# Altium schematic sheet MCU.SchDoc
size A4; SheetNumber: 10; SheetTotal: 11
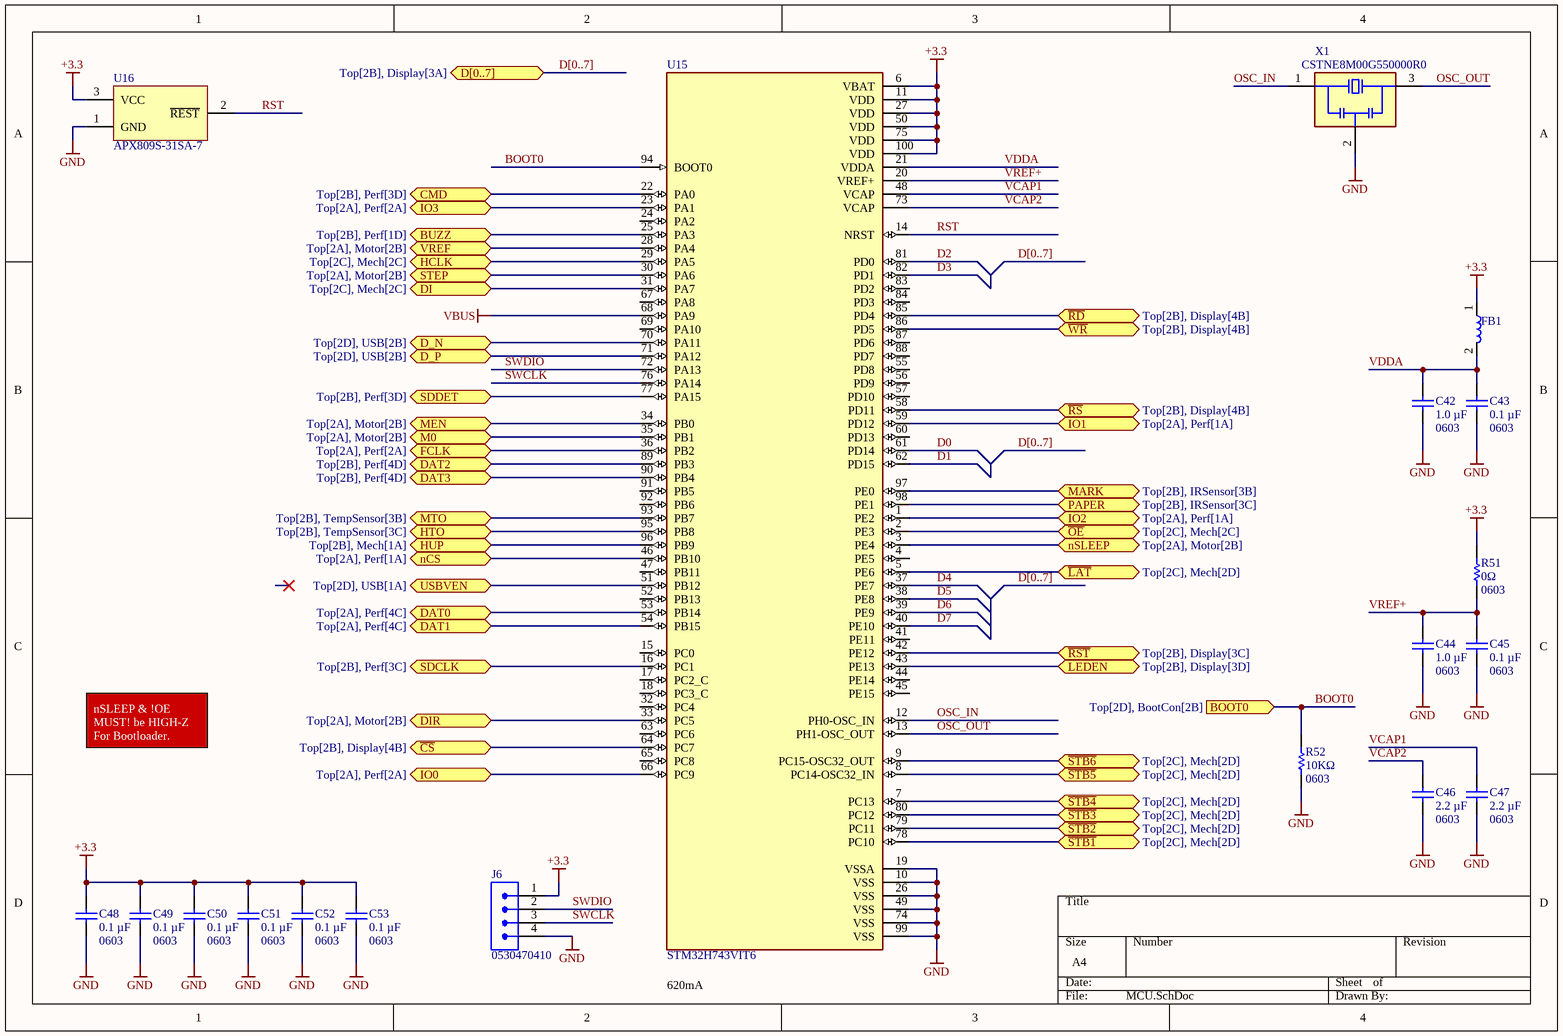
[diagram p0: MCU.SchDoc]

## Parts
C42  value 1.0 µF  [0603]  (hidden comment: GRM188D71H105KE01J)
C43  value 0.1 µF  [0603]  (hidden comment: GRM188R72A104MA35J)
C44  value 1.0 µF  [0603]  (hidden comment: GRM188D71H105KE01J)
C45  value 0.1 µF  [0603]  (hidden comment: GRM188R72A104MA35J)
C46  value 2.2 µF  [0603]  (hidden comment: GRM188R61E225KA12J)
C47  value 2.2 µF  [0603]  (hidden comment: GRM188R61E225KA12J)
C48  value 0.1 µF  [0603]  (hidden comment: GRM188R72A104MA35J)
C49  value 0.1 µF  [0603]  (hidden comment: GRM188R72A104MA35J)
C50  value 0.1 µF  [0603]  (hidden comment: GRM188R72A104MA35J)
C51  value 0.1 µF  [0603]  (hidden comment: GRM188R72A104MA35J)
C52  value 0.1 µF  [0603]  (hidden comment: GRM188R72A104MA35J)
C53  value 0.1 µF  [0603]  (hidden comment: GRM188R72A104MA35J)
FB1  MPZ1608S221ATA00  [0603]  (value not drawn)
J6  0530470410  [4POS]
R51  value 0Ω  [0603]  (hidden comment: RMCF0603ZT0R00)
R52  value 10KΩ  [0603]  (hidden comment: RMCF0603FG10K0)
U15  STM32H743VIT6  [100-LQFP]
U16  APX809S-31SA-7  [SOT-23-3]
X1  CSTNE8M00G550000R0  [3-SMD]

## Ports
BOOT0 (in, see Top[2D], BootCon[2B]), BUZZ (bidir, see Top[2B], Perf[1D]), CMD (bidir, see Top[2B], Perf[3D]), D[0..7] (bidir, see Top[2B], Display[3A]), D_N (bidir, see Top[2D], USB[2B]), D_P (bidir, see Top[2D], USB[2B]), DAT0 (bidir, see Top[2A], Perf[4C]), DAT1 (bidir, see Top[2A], Perf[4C]), DAT2 (bidir, see Top[2B], Perf[4D]), DAT3 (bidir, see Top[2B], Perf[4D]), DI (bidir, see Top[2C], Mech[2C]), DIR (bidir, see Top[2A], Motor[2B]), FCLK (bidir, see Top[2A], Perf[2A]), HCLK (bidir, see Top[2C], Mech[2C]), HTO (bidir, see Top[2B], TempSensor[3C]), HUP (bidir, see Top[2B], Mech[1A]), IO0 (bidir, see Top[2A], Perf[2A]), IO1 (bidir, see Top[2A], Perf[1A]), IO2 (bidir, see Top[2A], Perf[1A]), IO3 (bidir, see Top[2A], Perf[2A]), LEDEN (bidir, see Top[2B], Display[3D]), M0 (bidir, see Top[2A], Motor[2B]), MARK (bidir, see Top[2B], IRSensor[3B]), MEN (bidir, see Top[2A], Motor[2B]), MTO (bidir, see Top[2B], TempSensor[3B]), nCS (bidir, see Top[2A], Perf[1A]), nSLEEP (bidir, see Top[2A], Motor[2B]), PAPER (bidir, see Top[2B], IRSensor[3C]), SDCLK (bidir, see Top[2B], Perf[3C]), SDDET (bidir, see Top[2B], Perf[3D]), STEP (bidir, see Top[2A], Motor[2B]), USBVEN (bidir, see Top[2D], USB[1A]), VREF (bidir, see Top[2A], Motor[2B]), ~{CS} (bidir, see Top[2B], Display[4B]), ~{LAT} (bidir, see Top[2C], Mech[2D]), ~{OE} (bidir, see Top[2C], Mech[2C]), ~{RD} (bidir, see Top[2B], Display[4B]), ~{RST} (bidir, see Top[2B], Display[3C]), ~{RS} (bidir, see Top[2B], Display[4B]), ~{STB1} (bidir, see Top[2C], Mech[2D]), ~{STB2} (bidir, see Top[2C], Mech[2D]), ~{STB3} (bidir, see Top[2C], Mech[2D]), ~{STB4} (bidir, see Top[2C], Mech[2D]), ~{STB5} (bidir, see Top[2C], Mech[2D]), ~{STB6} (bidir, see Top[2C], Mech[2D]), ~{WR} (bidir, see Top[2B], Display[4B])

## Nets
+3.3: C48.2 C49.2 C50.2 C51.2 C52.2 C53.2 FB1.1 J6.1 R51.1 U15.6(VBAT) U15.11(VDD) U15.27(VDD) U15.50(VDD) U15.75(VDD) U15.100(VDD) U16.3(VCC)
GND: C42.1 C43.1 C44.1 C45.1 C46.1 C47.1 C48.1 C49.1 C50.1 C51.1 C52.1 C53.1 J6.4 R52.1 U15.10(VSS) U15.19(VSSA) U15.26(VSS) U15.49(VSS) U15.74(VSS) U15.99(VSS) U16.1(GND) X1.2(GND)
VBUS: U15.68(PA9)
BOOT0: R52.2 U15.94(BOOT0) ; port BOOT0
BUZZ: U15.25(PA3) ; port BUZZ
~{CS}: U15.64(PC7) ; port ~{CS}
CMD: U15.22(PA0) ; port CMD
D0: U15.61(PD14)
D1: U15.62(PD15)
D2: U15.81(PD0)
D3: U15.82(PD1)
D4: U15.37(PE7)
D5: U15.38(PE8)
D6: U15.39(PE9)
D7: U15.40(PE10)
D_N: U15.70(PA11) ; port D_N
D_P: U15.71(PA12) ; port D_P
DAT0: U15.53(PB14) ; port DAT0
DAT1: U15.54(PB15) ; port DAT1
DAT2: U15.89(PB3) ; port DAT2
DAT3: U15.90(PB4) ; port DAT3
DI: U15.31(PA7) ; port DI
DIR: U15.33(PC5) ; port DIR
FCLK: U15.36(PB2) ; port FCLK
HCLK: U15.29(PA5) ; port HCLK
HTO: U15.95(PB8) ; port HTO
HUP: U15.96(PB9) ; port HUP
IO0: U15.66(PC9) ; port IO0
IO1: U15.59(PD12) ; port IO1
IO2: U15.1(PE2) ; port IO2
IO3: U15.23(PA1) ; port IO3
~{LAT}: U15.5(PE6) ; port ~{LAT}
LEDEN: U15.43(PE13) ; port LEDEN
M0: U15.35(PB1) ; port M0
MARK: U15.97(PE0) ; port MARK
MEN: U15.34(PB0) ; port MEN
MTO: U15.93(PB7) ; port MTO
nCS: U15.46(PB10) ; port nCS
nSLEEP: U15.3(PE4) ; port nSLEEP
~{OE}: U15.2(PE3) ; port ~{OE}
OSC_IN: U15.12(PH0-OSC_IN) X1.1(IN)
OSC_OUT: U15.13(PH1-OSC_OUT) X1.3(OUT)
PAPER: U15.98(PE1) ; port PAPER
~{RD}: U15.85(PD4) ; port ~{RD}
~{RS}: U15.58(PD11) ; port ~{RS}
~{RST}: U15.42(PE12) ; port ~{RST}
RST: U15.14(NRST) U16.2(~{REST})
~{STB1}: U15.78(PC10) ; port ~{STB1}
~{STB2}: U15.79(PC11) ; port ~{STB2}
~{STB3}: U15.80(PC12) ; port ~{STB3}
~{STB4}: U15.7(PC13) ; port ~{STB4}
~{STB5}: U15.8(PC14-OSC32_IN) ; port ~{STB5}
~{STB6}: U15.9(PC15-OSC32_OUT) ; port ~{STB6}
SDCLK: U15.16(PC1) ; port SDCLK
SDDET: U15.77(PA15) ; port SDDET
STEP: U15.30(PA6) ; port STEP
SWCLK: J6.3 U15.76(PA14)
SWDIO: J6.2 U15.72(PA13)
USBVEN: U15.51(PB12) ; port USBVEN
VCAP1: C47.2 U15.48(VCAP)
VCAP2: C46.2 U15.73(VCAP)
VDDA: C42.2 C43.2 FB1.2 U15.21(VDDA)
VREF: U15.28(PA4) ; port VREF
VREF+: C44.2 C45.2 R51.2 U15.20(VREF+)
~{WR}: U15.86(PD5) ; port ~{WR}

Not connected (* = marked no-connect by the designer): U15 4(PE5) 15(PC0) 17(PC2_C) 18(PC3_C) 24(PA2) 32(PC4) 41(PE11) 44(PE14) 45(PE15) 47(PB11) 52(PB13) 55(PD8) 56(PD9) 57(PD10) 60(PD13) 63(PC6) 65(PC8) 67(PA8) 69(PA10) 83(PD2) 84(PD3) 87(PD6) 88(PD7) 91(PB5) 92(PB6)

## Buses and harness runs
bus D[0..7]
bus D[0..7] = port D[0..7]

## Notes on the sheet
- nSLEEP & !OE MUST! be HIGH-Z
  For Bootloader.
- (near U15) 620mA

## Library data of the parts
C42 C44 = GRM188D71H105KE01J: 1 µF ±10% 50V Ceramic Capacitor X7T 0603 (1608 Metric); Case: 0603; Tolerance: ±10%; Temperature Coefficient: X7T; Voltage: 50V
C43 C45 C48-C53 = GRM188R72A104MA35J: 0.1 µF ±20% 100V Ceramic Capacitor X7R 0603 (1608 Metric); Case: 0603; Tolerance: ±20%; Temperature Coefficient: X7R; Voltage: 100V
C46 C47 = GRM188R61E225KA12J: 2.2 µF ±10% 25V Ceramic Capacitor X5R 0603 (1608 Metric); Case: 0603; Tolerance: ±10%; Temperature Coefficient: X5R; Voltage: 25V
FB1 = MPZ1608S221ATA00: 220 Ohms @ 100 MHz 1 Power Line Ferrite Bead 0603 (1608 Metric) 2.2A 50mOhm
J6 = 0530470410: Connector Header Through Hole 4 position 0.049" (1.25mm)
R51 = RMCF0603ZT0R00: 0 Ohms Jumper Chip Resistor 0603 (1608 Metric) Automotive AEC-Q200 Thick Film; Tolerance: 0; Case: 0603; Power: 0
R52 = RMCF0603FG10K0: 10 kOhms ±1% 0.1W, 1/10W Chip Resistor 0603 (1608 Metric) Automotive AEC-Q200 Thick Film; Case: 0603; Tolerance: 1%; Power: 0.1W
U15 = STM32H743VIT6: ARM® Cortex®-M7 STM32H7 Microcontroller IC 32-Bit Single-Core 480MHz 2MB (2M x 8) FLASH 100-LQFP (14x14)
U16 = APX809S-31SA-7: Supervisor Push-Pull, Totem Pole 1 Channel SOT-23-3
X1 = CSTNE8M00G550000R0: 8 MHz Ceramic Resonator Built in Capacitor 33 pF ±0.2% 40 Ohms -40°C ~ 85°C Surface Mount